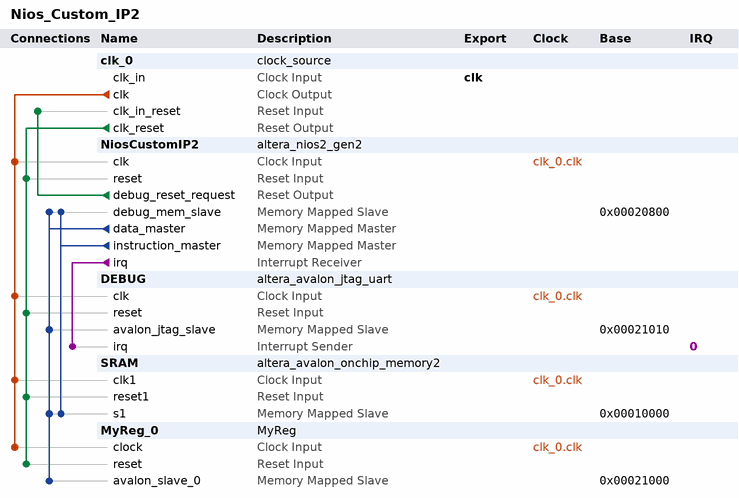
[diagram p0: system contents]
# Platform Designer (Qsys) system Nios_Custom_IP2, MAX 10 10M50DAF484C6GES
# Parameters at their usual value, and those the tool derives, are not listed.
package require -exact qsys 22.1
create_system Nios_Custom_IP2
set_project_property DEVICE_FAMILY {MAX 10}
set_project_property DEVICE 10M50DAF484C6GES

add_instance clk_0 clock_source 22.1
set_instance_parameter_value clk_0 clockFrequency 50000000

add_instance NiosCustomIP2 altera_nios2_gen2 22.1
set_instance_parameter_value NiosCustomIP2 dcache_size 2048
set_instance_parameter_value NiosCustomIP2 exceptionSlave SRAM.s1
set_instance_parameter_value NiosCustomIP2 icache_size 4096
set_instance_parameter_value NiosCustomIP2 impl Tiny
set_instance_parameter_value NiosCustomIP2 resetSlave SRAM.s1

add_instance DEBUG altera_avalon_jtag_uart 22.1
set_instance_parameter_value DEBUG simInteractiveOptions NO_INTERACTIVE_WINDOWS

add_instance SRAM altera_avalon_onchip_memory2 22.1
set_instance_parameter_value SRAM dataWidth 32
set_instance_parameter_value SRAM dualPort false
set_instance_parameter_value SRAM initMemContent true
set_instance_parameter_value SRAM initializationFileName onchip_mem.hex
set_instance_parameter_value SRAM memorySize 40960

add_instance MyReg_0 MyReg 1.0

# connections
add_connection clk_0.clk DEBUG.clk clock
add_connection clk_0.clk MyReg_0.clock clock
add_connection clk_0.clk NiosCustomIP2.clk clock
add_connection clk_0.clk SRAM.clk1 clock
add_connection clk_0.clk_reset DEBUG.reset reset
add_connection clk_0.clk_reset MyReg_0.reset reset
add_connection clk_0.clk_reset NiosCustomIP2.reset reset
add_connection clk_0.clk_reset SRAM.reset1 reset
add_connection NiosCustomIP2.debug_reset_request clk_0.clk_in_reset reset
add_connection NiosCustomIP2.data_master DEBUG.avalon_jtag_slave avalon
set_connection_parameter_value NiosCustomIP2.data_master/DEBUG.avalon_jtag_slave baseAddress 0x00021010
add_connection NiosCustomIP2.data_master MyReg_0.avalon_slave_0 avalon
set_connection_parameter_value NiosCustomIP2.data_master/MyReg_0.avalon_slave_0 baseAddress 0x00021000
add_connection NiosCustomIP2.data_master NiosCustomIP2.debug_mem_slave avalon
set_connection_parameter_value NiosCustomIP2.data_master/NiosCustomIP2.debug_mem_slave baseAddress 0x00020800
add_connection NiosCustomIP2.data_master SRAM.s1 avalon
set_connection_parameter_value NiosCustomIP2.data_master/SRAM.s1 baseAddress 0x00010000
add_connection NiosCustomIP2.instruction_master NiosCustomIP2.debug_mem_slave avalon
set_connection_parameter_value NiosCustomIP2.instruction_master/NiosCustomIP2.debug_mem_slave baseAddress 0x00020800
add_connection NiosCustomIP2.instruction_master SRAM.s1 avalon
set_connection_parameter_value NiosCustomIP2.instruction_master/SRAM.s1 baseAddress 0x00010000
add_connection NiosCustomIP2.irq DEBUG.irq interrupt
set_connection_parameter_value NiosCustomIP2.irq/DEBUG.irq irqNumber 0

# exported interfaces
add_interface clk clock sink
set_interface_property clk EXPORT_OF clk_0.clk_in

set_interconnect_requirement {$system} qsys_mm.clockCrossingAdapter HANDSHAKE
set_interconnect_requirement {$system} qsys_mm.enableEccProtection FALSE
set_interconnect_requirement {$system} qsys_mm.insertDefaultSlave FALSE
set_interconnect_requirement {$system} qsys_mm.maxAdditionalLatency 1

save_system Nios_Custom_IP2.qsys
